# EAGLE schematic centerbody_Combine (EAGLE 9.5.2)
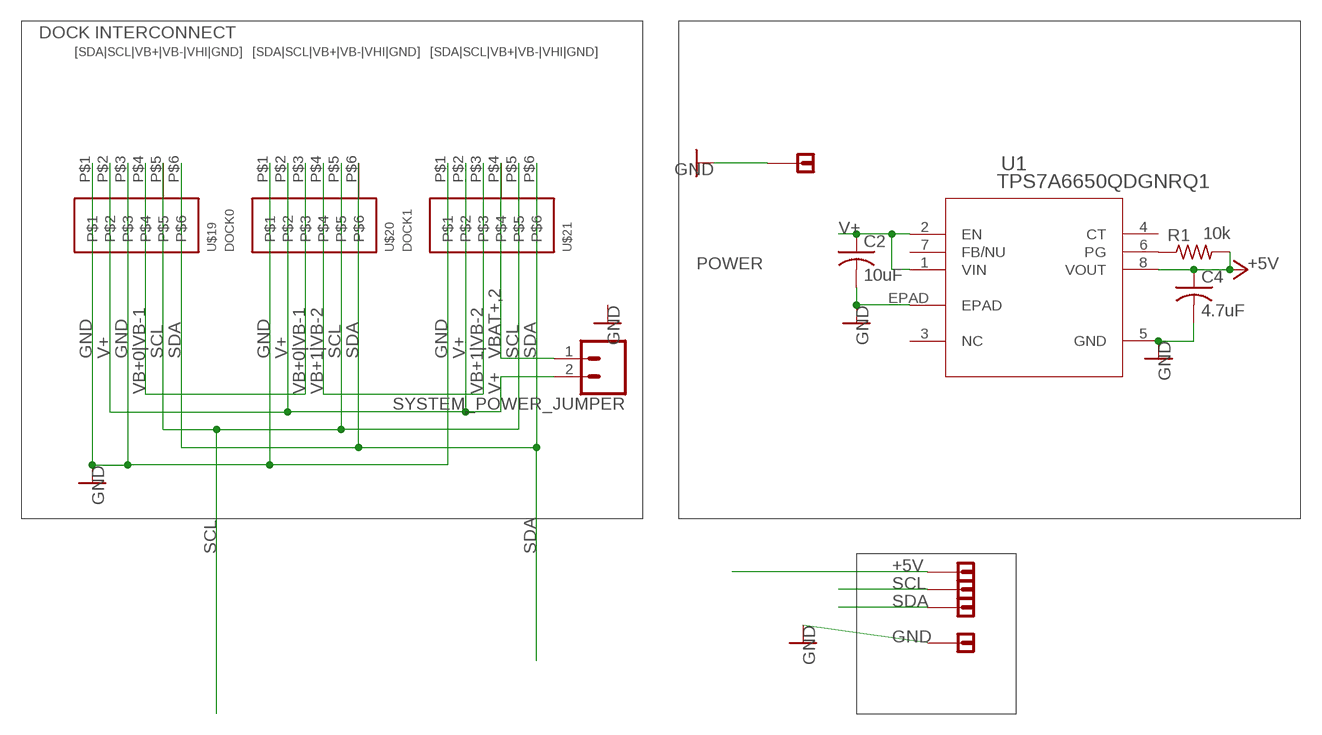
[diagram p0: schematic, sheet 1]

## Parts
C2  10uF  C-USC1206  [C1206]
C4  4.7uF  C-USC0402  [C0402]
R1  10k  R-US_R0402  [R0402]
SYSTEM_POWER_JUMPER  CONN_02  [1X02]
U1  TPS7A6650QDGNRQ1  [DGN8_1P57X1P89]
U$1  SIMPLE_VIA_CONNECTION  [SIMPLEVIA]
U$3  SIMPLE_VIA_CONNECTION  [SIMPLEVIA]
U$4  SIMPLE_VIA_CONNECTION  [SIMPLEVIA]
U$7  SIMPLE_VIA_CONNECTION  [SIMPLEVIA]
U$9  SIMPLE_VIA_CONNECTION  [SIMPLEVIA]
U$19  DOCK0  COMPACT_6CONNSTRAIGHT  [COMPACT_6CONN_STRAIGHT]
U$20  DOCK1  COMPACT_6CONNSTRAIGHT  [COMPACT_6CONN_STRAIGHT]
U$21  DOCK_2  COMPACT_6CONNSTRAIGHT  [COMPACT_6CONN_STRAIGHT]

## Nets
+5V [Low Power]: C4.1 R1.2 U1.8(VOUT) U$7.P$1
GND: C2.2 C4.2 U1.5(GND) U1.EPAD U$1.P$1 U$3.P$1 U$19.P$1 U$19.P$3 U$20.P$1 U$21.P$1
PG [Signal]: R1.1 U1.6(PG)
SCL [Signal]: U$9.P$1 U$19.P$5 U$20.P$5 U$21.P$5
SDA [Signal]: U$4.P$1 U$19.P$6 U$20.P$6 U$21.P$6
V+ [High Power]: C2.1 SYSTEM_POWER_JUMPER.2 U1.1(VIN) U1.2(EN) U$19.P$2 U$20.P$2 U$21.P$2
VB+0|VB-1: U$19.P$4 U$20.P$3
VB+1|VB-2: U$20.P$4 U$21.P$3
VBAT+,2 [High Power]: SYSTEM_POWER_JUMPER.1 U$21.P$4
Unconnected: U1.3(NC) U1.4(CT) U1.7(FB/NU)

## Notes on the sheet
- DOCK INTERCONNECT
- [SDA|SCL|VB+|VB-|VHI|GND] | [SDA|SCL|VB+|VB-|VHI|GND] | [SDA|SCL|VB+|VB-|VHI|GND]
- POWER

## Library data of the parts
C2 = FA3D_lib:C-US: CAPACITOR, American symbol
C4 = resistor:C-US: CAPACITOR, American symbol
R1 = FA3D_lib:R-US_: RESISTOR, American symbol
SYSTEM_POWER_JUMPER = SparkFun-Connectors:CONN_02: Multi connection point. Often used as Generic Header-pin footprint for 0.1 inch spaced/style header connections On any of the 0.1 inch spaced packages, you can populate with these: Break Away Headers - Straight <https://www.sparkfun.com/products/116> (PRT-00116) Break Away Male Headers - Right Angle <https://www.sparkfun.com/products/553> (PRT-00553) Female Headers <https://www.sparkfun.com/products/115> (PRT-00115) Break Away Headers - Machine Pin <https://www.sparkfun.com/products/117> (PRT-00117) Break Away Female Headers - Swiss Machine Pin <https://www.sparkfun.com/products/743> (PRT-00743) For SCREWTERMINALS and SPRING TERMINALS visit here: Screw Terimnals on SparkFun.com <https://www.sparkfun.com/search/results?term=Screw+Terminals> (5mm/3.5mm/2.54mm spacing) This device is also useful as a general connection point to wire up your design to another part of your project. Our various solder wires solder well into these plated through hole pads. Hook-Up Wire - Assortment (Stranded, 22 AWG) <https://www.sparkfun.com/products/11375> (PRT-11375) Hook-Up Wire - Assortment (Solid Core, 22 AWG) <https://www.sparkfun.com/products/11367> (PRT-11367) View the entire wire category on our website here <https://www.sparkfun.com/categories/141> Special notes: Molex polarized connector foot print use with: PRT-08233 with associated crimp pins and housings. 2.54_SCREWTERM for use with PRT-10571. 3.5mm Screw Terminal footprints for PRT-08084 5mm Screw Terminal footprints for use with PRT-08432
U1 = FA3D_lib:TPS7A6650QDGNRQ1; MANUFACTURER_PART_NUMBER: TPS7A6650QDGNRQ1; VENDOR: Texas Instruments
U$1 U$3 U$4 U$7 U$9 = FA3D_lib:SIMPLE_VIA_CONNECTION
U$19-U$21 = FA3D_lib:COMPACT_6CONN

## Net classes
1 Signal: width 0.2 mm, drill 0.3 mm
2 High Power: width 0.75 mm, drill 0.5 mm
3 Low Power: width 0.2 mm, drill 0.3 mm